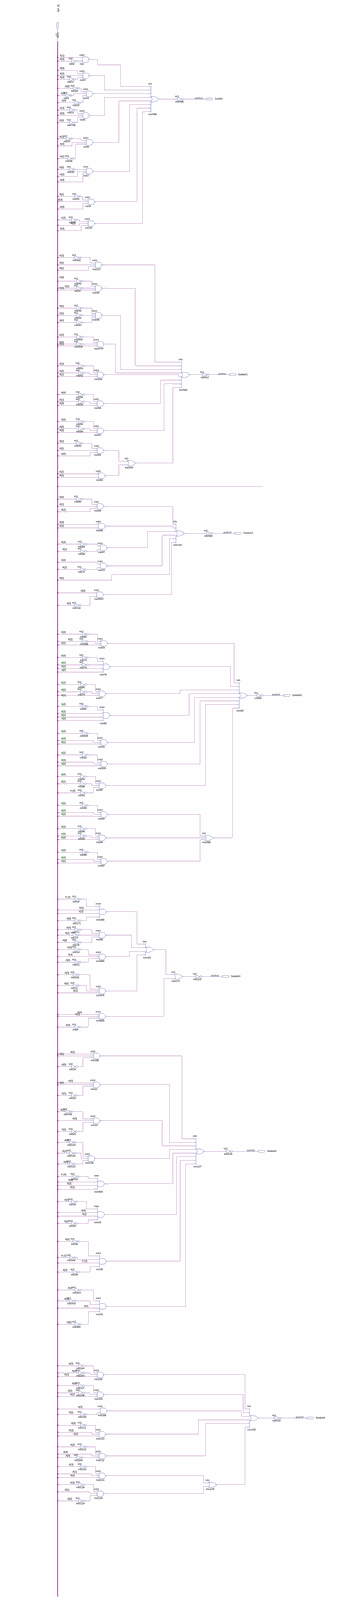
[diagram p0: schematic sheet, whole]
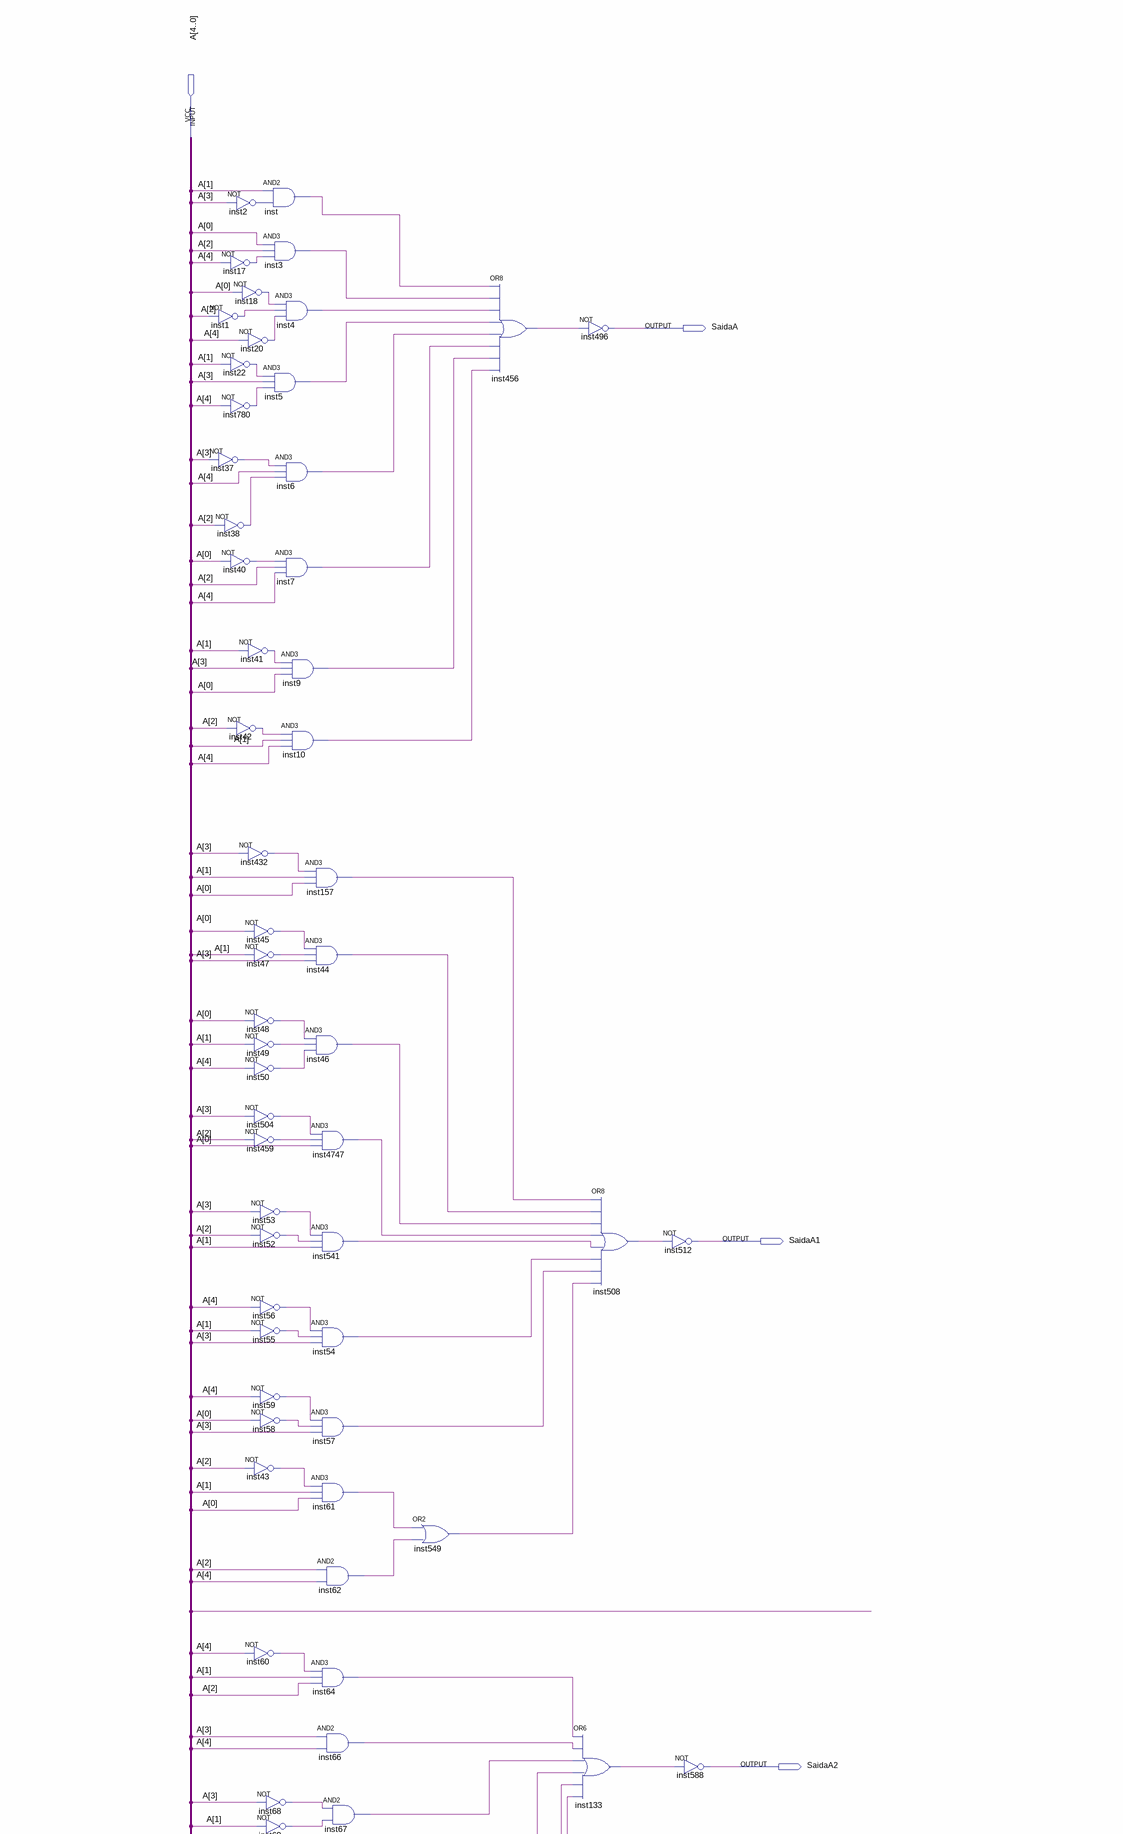
[diagram p1: schematic sheet, upper part]
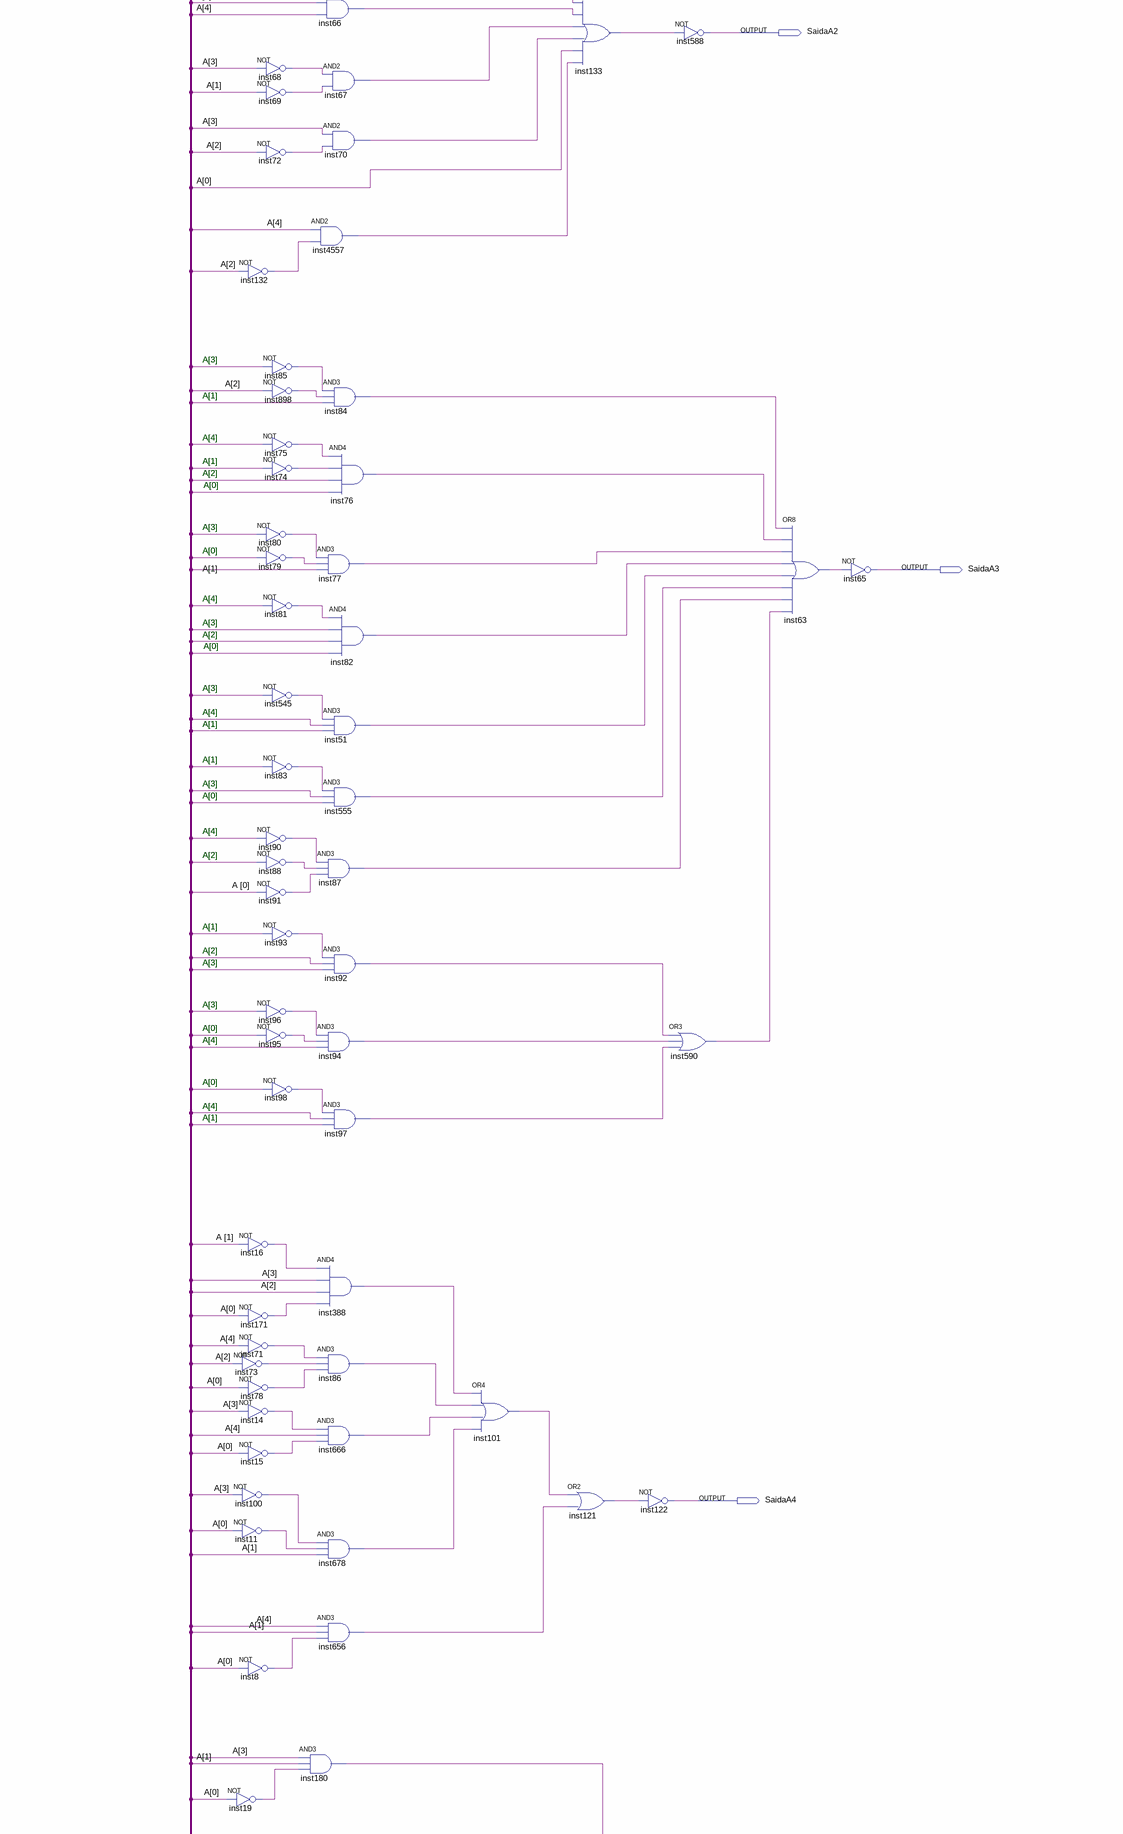
[diagram p2: schematic sheet, middle part]
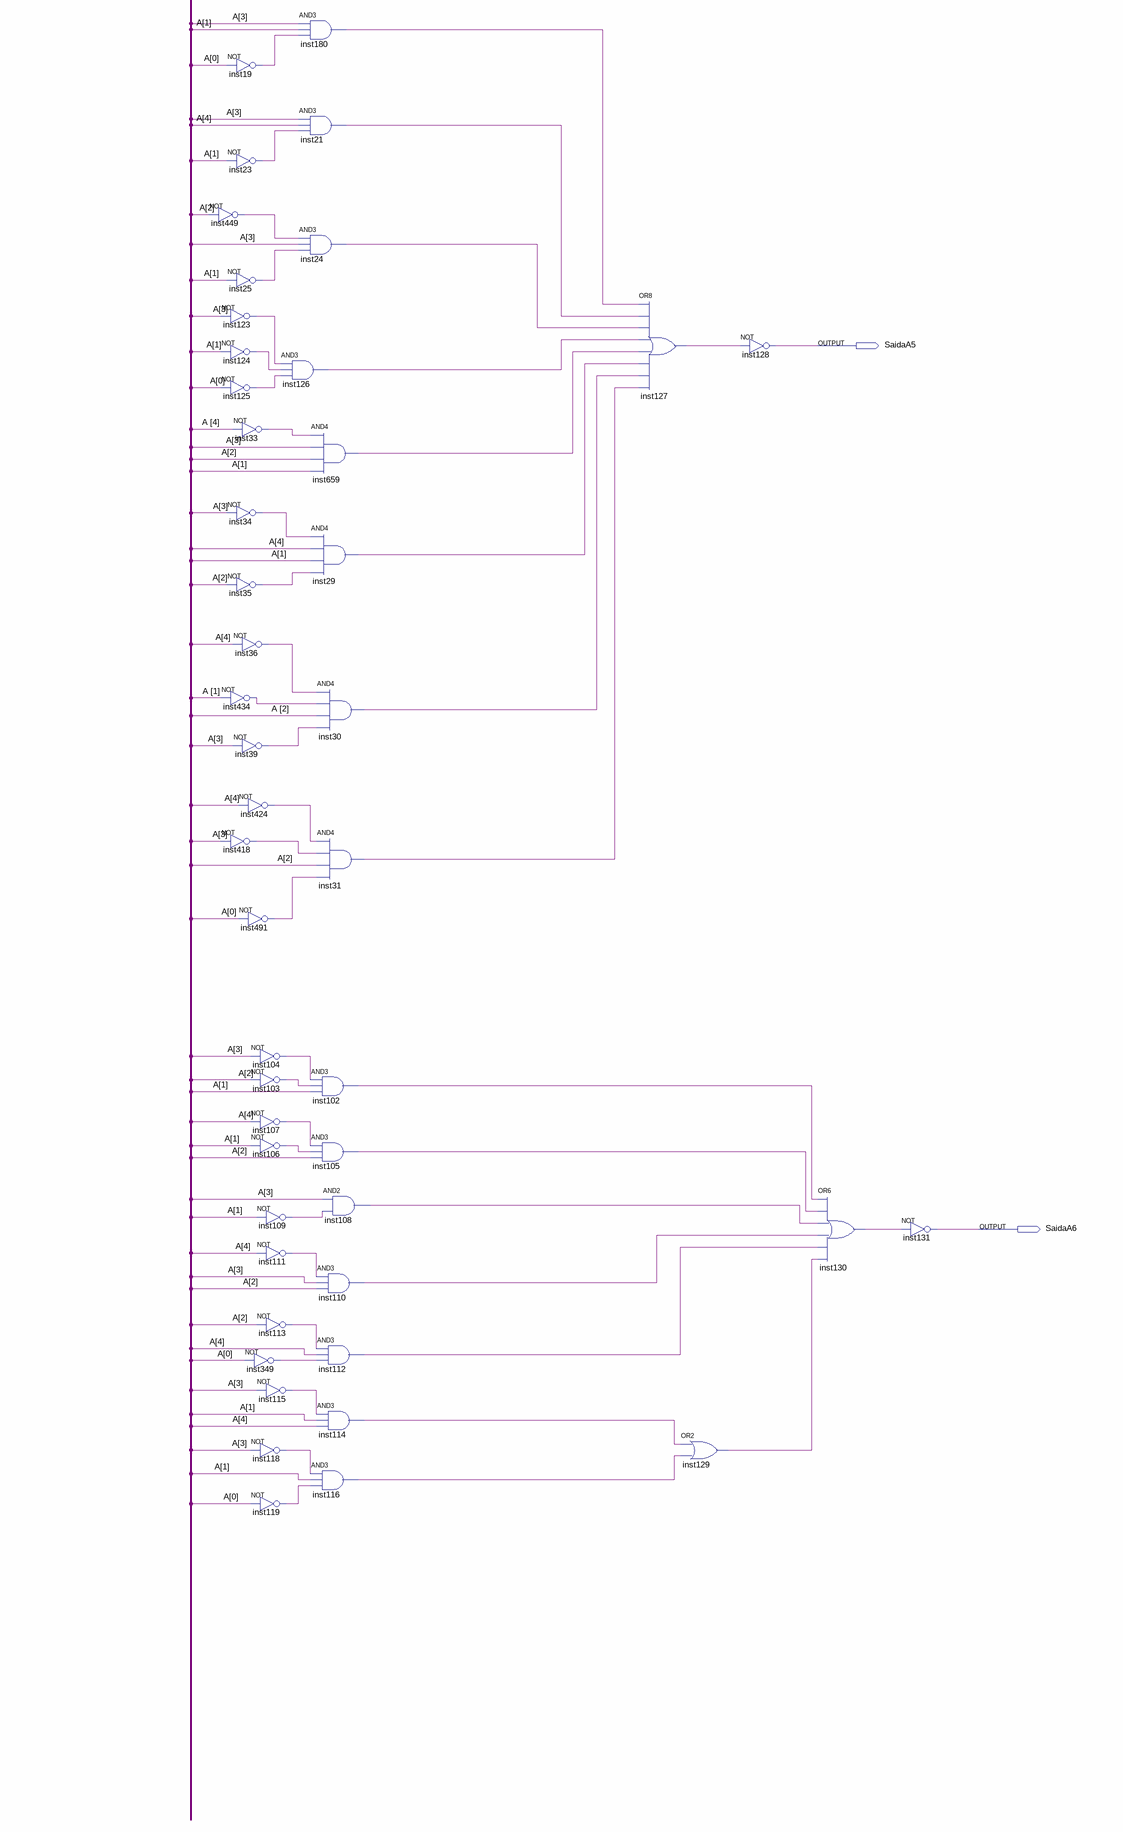
[diagram p3: schematic sheet, lower part]
// Quartus schematic Display7Unidade.bdf as structural Verilog: 155 symbols, 8 pins
module Display7Unidade (
  input  [4:0] A,
  output SaidaA,
  output SaidaA1,
  output SaidaA2,
  output SaidaA3,
  output SaidaA4,
  output SaidaA5,
  output SaidaA6
);

  wire inst1_out, inst2_out, inst3_out, inst4_out, inst5_out, inst6_out, inst7_out, inst8_out, inst9_out,
       inst10_out, inst11_out, inst14_out, inst15_out, inst16_out, inst17_out, inst18_out, inst19_out,
       inst20_out, inst21_out, inst22_out, inst23_out, inst24_out, inst25_out, inst29_out, inst30_out,
       inst31_out, inst33_out, inst34_out, inst35_out, inst36_out, inst37_out, inst38_out, inst39_out,
       inst40_out, inst41_out, inst42_out, inst43_out, inst44_out, inst45_out, inst46_out, inst47_out,
       inst48_out, inst49_out, inst50_out, inst51_out, inst52_out, inst53_out, inst54_out, inst55_out,
       inst56_out, inst57_out, inst58_out, inst59_out, inst60_out, inst61_out, inst62_out, inst63_out,
       inst64_out, inst66_out, inst67_out, inst68_out, inst69_out, inst70_out, inst71_out, inst72_out,
       inst73_out, inst74_out, inst75_out, inst76_out, inst77_out, inst78_out, inst79_out, inst80_out,
       inst81_out, inst82_out, inst83_out, inst84_out, inst85_out, inst86_out, inst87_out, inst88_out,
       inst90_out, inst91_out, inst92_out, inst93_out, inst94_out, inst95_out, inst96_out, inst97_out,
       inst98_out, inst100_out, inst101_out, inst102_out, inst103_out, inst104_out, inst105_out, inst106_out,
       inst107_out, inst108_out, inst109_out, inst110_out, inst111_out, inst112_out, inst113_out,
       inst114_out, inst115_out, inst116_out, inst118_out, inst119_out, inst121_out, inst123_out,
       inst124_out, inst125_out, inst126_out, inst127_out, inst129_out, inst130_out, inst132_out,
       inst133_out, inst157_out, inst171_out, inst180_out, inst349_out, inst388_out, inst418_out,
       inst424_out, inst432_out, inst434_out, inst449_out, inst456_out, inst459_out, inst491_out,
       inst504_out, inst508_out, inst541_out, inst545_out, inst549_out, inst555_out, inst590_out,
       inst656_out, inst659_out, inst666_out, inst678_out, inst780_out, inst898_out, inst4557_out,
       inst4747_out, inst_out;

  not inst2 (inst2_out, A[3]);
  not inst17 (inst17_out, A[4]);
  not inst18 (inst18_out, A[0]);
  not inst1 (inst1_out, A[2]);
  not inst20 (inst20_out, A[4]);
  not inst22 (inst22_out, A[1]);
  not inst780 (inst780_out, A[4]);
  not inst37 (inst37_out, A[3]);
  not inst38 (inst38_out, A[2]);
  not inst40 (inst40_out, A[0]);
  not inst41 (inst41_out, A[1]);
  not inst42 (inst42_out, A[2]);
  not inst432 (inst432_out, A[3]);
  not inst45 (inst45_out, A[0]);
  not inst47 (inst47_out, A[1]);
  not inst48 (inst48_out, A[0]);
  not inst49 (inst49_out, A[1]);
  not inst50 (inst50_out, A[4]);
  not inst504 (inst504_out, A[3]);
  not inst459 (inst459_out, A[2]);
  not inst43 (inst43_out, A[2]);
  not inst60 (inst60_out, A[4]);
  not inst132 (inst132_out, A[2]);
  not inst16 (inst16_out, A[1]);
  not inst171 (inst171_out, A[0]);
  not inst71 (inst71_out, A[4]);
  not inst73 (inst73_out, A[2]);
  not inst78 (inst78_out, A[0]);
  not inst14 (inst14_out, A[3]);
  not inst15 (inst15_out, A[0]);
  not inst100 (inst100_out, A[3]);
  not inst11 (inst11_out, A[0]);
  not inst8 (inst8_out, A[0]);
  not inst19 (inst19_out, A[0]);
  not inst23 (inst23_out, A[1]);
  not inst449 (inst449_out, A[2]);
  not inst25 (inst25_out, A[1]);
  not inst123 (inst123_out, A[3]);
  not inst124 (inst124_out, A[1]);
  not inst125 (inst125_out, A[0]);
  not inst33 (inst33_out, A[4]);
  not inst34 (inst34_out, A[3]);
  not inst35 (inst35_out, A[2]);
  not inst36 (inst36_out, A[4]);
  not inst434 (inst434_out, A[1]);
  not inst39 (inst39_out, A[3]);
  not inst424 (inst424_out, A[4]);
  not inst418 (inst418_out, A[3]);
  not inst491 (inst491_out, A[0]);
  not inst349 (inst349_out, A[0]);
  and inst (inst_out, A[1], inst2_out);
  and inst3 (inst3_out, A[0], A[2], inst17_out);
  and inst4 (inst4_out, inst18_out, inst1_out, inst20_out);
  and inst5 (inst5_out, inst22_out, A[3], inst780_out);
  and inst6 (inst6_out, inst37_out, A[4], inst38_out);
  and inst7 (inst7_out, inst40_out, A[2], A[4]);
  and inst9 (inst9_out, inst41_out, A[3], A[0]);
  and inst10 (inst10_out, inst42_out, A[1], A[4]);
  not inst53 (inst53_out, A[3]);
  not inst52 (inst52_out, A[2]);
  not inst56 (inst56_out, A[4]);
  not inst55 (inst55_out, A[1]);
  not inst59 (inst59_out, A[4]);
  not inst58 (inst58_out, A[0]);
  not inst68 (inst68_out, A[3]);
  not inst69 (inst69_out, A[1]);
  not inst72 (inst72_out, A[2]);
  not inst85 (inst85_out, A[3]);
  not inst898 (inst898_out, A[2]);
  not inst75 (inst75_out, A[4]);
  not inst74 (inst74_out, A[1]);
  not inst80 (inst80_out, A[3]);
  not inst79 (inst79_out, A[0]);
  not inst81 (inst81_out, A[4]);
  not inst545 (inst545_out, A[3]);
  not inst83 (inst83_out, A[1]);
  not inst90 (inst90_out, A[4]);
  not inst88 (inst88_out, A[2]);
  not inst91 (inst91_out, A[0]);
  not inst93 (inst93_out, A[1]);
  not inst96 (inst96_out, A[3]);
  not inst95 (inst95_out, A[0]);
  not inst98 (inst98_out, A[0]);
  and inst126 (inst126_out, inst123_out, inst124_out, inst125_out);
  not inst104 (inst104_out, A[3]);
  not inst103 (inst103_out, A[2]);
  not inst107 (inst107_out, A[4]);
  not inst106 (inst106_out, A[1]);
  not inst109 (inst109_out, A[1]);
  not inst111 (inst111_out, A[4]);
  not inst113 (inst113_out, A[2]);
  not inst115 (inst115_out, A[3]);
  not inst118 (inst118_out, A[3]);
  not inst119 (inst119_out, A[0]);
  and inst157 (inst157_out, inst432_out, A[1], A[0]);
  and inst44 (inst44_out, inst45_out, inst47_out, A[3]);
  and inst46 (inst46_out, inst48_out, inst49_out, inst50_out);
  and inst4747 (inst4747_out, inst504_out, inst459_out, A[0]);
  and inst541 (inst541_out, inst53_out, inst52_out, A[1]);
  and inst54 (inst54_out, inst56_out, inst55_out, A[3]);
  and inst57 (inst57_out, inst59_out, inst58_out, A[3]);
  and inst61 (inst61_out, inst43_out, A[1], A[0]);
  and inst62 (inst62_out, A[2], A[4]);
  and inst64 (inst64_out, inst60_out, A[1], A[2]);
  and inst66 (inst66_out, A[3], A[4]);
  and inst67 (inst67_out, inst68_out, inst69_out);
  and inst70 (inst70_out, A[3], inst72_out);
  and inst4557 (inst4557_out, A[4], inst132_out);
  and inst84 (inst84_out, inst85_out, inst898_out, A[1]);
  and inst76 (inst76_out, inst75_out, inst74_out, A[2], A[0]);
  and inst77 (inst77_out, inst80_out, inst79_out, A[1]);
  and inst82 (inst82_out, inst81_out, A[3], A[2], A[0]);
  and inst51 (inst51_out, inst545_out, A[4], A[1]);
  and inst555 (inst555_out, inst83_out, A[3], A[0]);
  and inst87 (inst87_out, inst90_out, inst88_out, inst91_out);
  and inst92 (inst92_out, inst93_out, A[2], A[3]);
  and inst94 (inst94_out, inst96_out, inst95_out, A[4]);
  and inst97 (inst97_out, inst98_out, A[4], A[1]);
  and inst388 (inst388_out, inst16_out, A[3], A[2], inst171_out);
  and inst86 (inst86_out, inst71_out, inst73_out, inst78_out);
  and inst666 (inst666_out, inst14_out, A[4], inst15_out);
  and inst678 (inst678_out, inst100_out, inst11_out, A[1]);
  and inst656 (inst656_out, A[4], A[1], inst8_out);
  and inst180 (inst180_out, A[3], A[1], inst19_out);
  and inst21 (inst21_out, A[3], A[4], inst23_out);
  and inst24 (inst24_out, inst449_out, A[3], inst25_out);
  and inst659 (inst659_out, inst33_out, A[3], A[2], A[1]);
  and inst29 (inst29_out, inst34_out, A[4], A[1], inst35_out);
  and inst30 (inst30_out, inst36_out, inst434_out, A[2], inst39_out);
  and inst31 (inst31_out, inst424_out, inst418_out, A[2], inst491_out);
  and inst102 (inst102_out, inst104_out, inst103_out, A[1]);
  and inst105 (inst105_out, inst107_out, inst106_out, A[2]);
  and inst108 (inst108_out, A[3], inst109_out);
  and inst110 (inst110_out, inst111_out, A[3], A[2]);
  and inst112 (inst112_out, inst113_out, A[4], inst349_out);
  and inst114 (inst114_out, inst115_out, A[1], A[4]);
  and inst116 (inst116_out, inst118_out, A[1], inst119_out);
  or inst549 (inst549_out, inst61_out, inst62_out);
  or inst101 (inst101_out, inst388_out, inst86_out, inst666_out, inst678_out);
  or inst456 (inst456_out, inst_out, inst3_out, inst4_out, inst5_out, inst6_out, inst7_out, inst9_out, inst10_out);
  not inst496 (SaidaA, inst456_out);
  or inst133 (inst133_out, inst64_out, inst66_out, inst67_out, inst70_out, A[0], inst4557_out);
  or inst121 (inst121_out, inst101_out, inst656_out);
  or inst508 (inst508_out, inst157_out, inst44_out, inst46_out, inst4747_out, inst541_out, inst54_out, inst57_out, inst549_out);
  not inst512 (SaidaA1, inst508_out);
  not inst588 (SaidaA2, inst133_out);
  or inst590 (inst590_out, inst92_out, inst94_out, inst97_out);
  not inst122 (SaidaA4, inst121_out);
  or inst127 (inst127_out, inst180_out, inst21_out, inst24_out, inst126_out, inst659_out, inst29_out, inst30_out, inst31_out);
  or inst129 (inst129_out, inst114_out, inst116_out);
  not inst128 (SaidaA5, inst127_out);
  or inst63 (inst63_out, inst84_out, inst76_out, inst77_out, inst82_out, inst51_out, inst555_out, inst87_out, inst590_out);
  or inst130 (inst130_out, inst102_out, inst105_out, inst108_out, inst110_out, inst112_out, inst129_out);
  not inst65 (SaidaA3, inst63_out);
  not inst131 (SaidaA6, inst130_out);

  // Notes on the sheet:
  //   A[3]
  //   A[1]
  //   A[4]
  //   A[1]
  //   A[2]
  //   A[0]
  //   A[3]
  //   A[0]
  //   A[4]
  //   A[3]
  //   A[2]
  //   A[0]
  //   A[3]
  //   A[4]
  //   A[1]
  //   A[1]
  //   A[3]
  //   A[0]
  //   A[4]
  //   A[2]
  //   A[1]
  //   A[2]
  //   A[3]
  //   A[3]
  //   A[0]
  //   A[4]
  //   A[0]
  //   A[4]
  //   A[1]
endmodule
